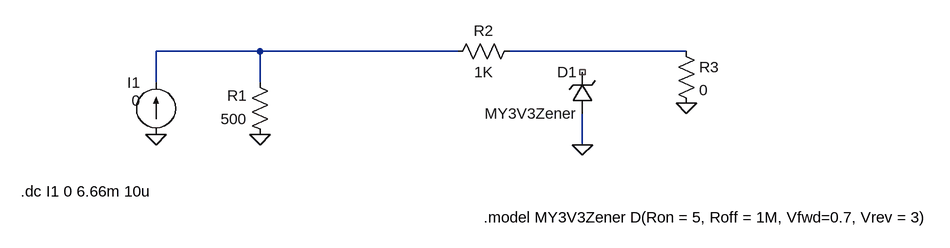
[diagram p0: schematic CurrentSense.asc]
CurrentSense.asc, the LTspice schematic file:
Version 4.1
SHEET 1 1372 680
WIRE 288 80 128 80
WIRE 592 80 288 80
WIRE 944 80 672 80
WIRE 128 128 128 80
WIRE 288 128 288 80
WIRE 784 224 784 176
FLAG 128 208 0
FLAG 288 208 0
FLAG 784 224 0
FLAG 944 160 0
SYMBOL current 128 208 R180
WINDOW 0 24 80 Left 2
WINDOW 3 24 52 Left 2
WINDOW 123 0 0 Left 0
WINDOW 39 0 0 Left 0
SYMATTR InstName I1
SYMATTR Value 0
SYMBOL res 304 224 R180
WINDOW 0 36 76 Left 2
WINDOW 3 36 40 Left 2
SYMATTR InstName R1
SYMATTR Value 500
SYMBOL res 688 64 R90
WINDOW 0 0 56 VBottom 2
WINDOW 3 32 56 VTop 2
SYMATTR InstName R2
SYMATTR Value 1K
SYMBOL res 928 64 R0
SYMATTR InstName R3
SYMATTR Value 0
SYMBOL zener 800 176 R180
WINDOW 0 24 64 Left 2
WINDOW 3 24 0 Left 2
SYMATTR InstName D1
SYMATTR Value MY3V3Zener
TEXT -80 296 Left 2 !.dc I1 0 6.66m 10u
TEXT 632 336 Left 2 !.model MY3V3Zener D(Ron = 5, Roff = 1M, Vfwd=0.7, Vrev = 3)

The netlist it stands for:
* CurrentSense.asc
I1 0 N001 0
R1 0 N001 500
R2 N002 N001 1K
R3 N002 0 0
D1 0 NC_01 MY3V3Zener
.model D D
.lib standard.dio
.dc I1 0 6.66m 10u
.model MY3V3Zener D(Ron = 5, Roff = 1M, Vfwd=0.7, Vrev = 3)
.backanno
.end